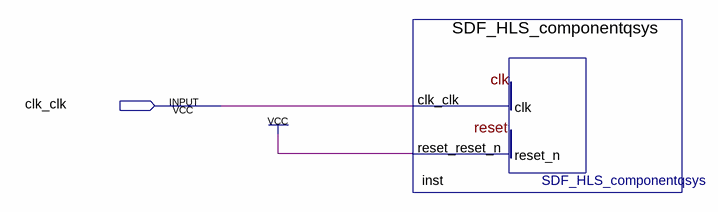
[diagram p0: schematic sheet]
// Quartus schematic FB_SDF.bdf as structural Verilog: 1 symbols, 1 pins
module FB_SDF (
  input  clk_clk
);

  SDF_HLS_componentqsys inst (.clk_clk(clk_clk), .reset_reset_n(1'b1));
endmodule
